# Altium schematic sheet 3.3v_Buck.SchDoc: 3.3v_Buck.SchDoc
size 558 x 431 mm; Date: 2/16/2022; Author: Xitong Zheng, Hongliang Chen; SheetNumber: 4; SheetTotal: 11
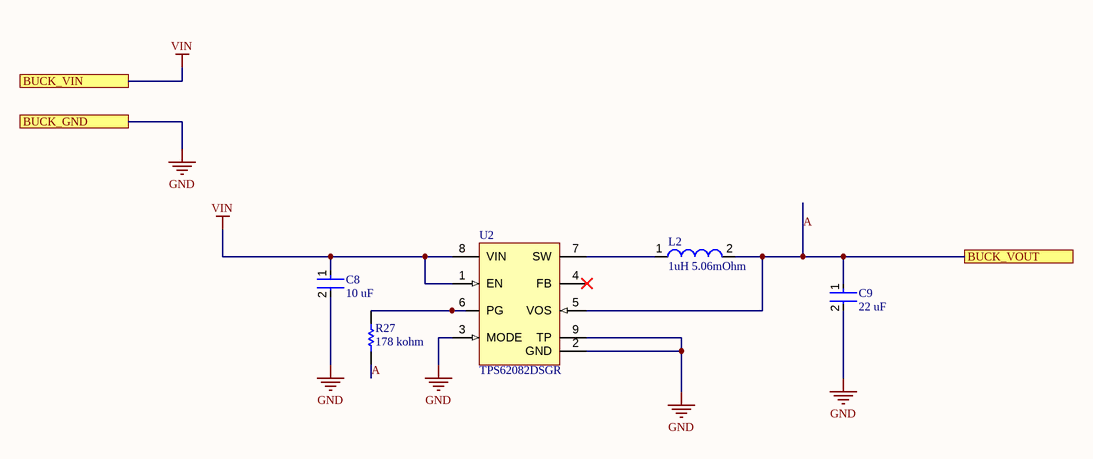
[diagram p0: 3.3v_Buck.SchDoc]

## Parts
C8  10 uF  [FP-GRJ155-0_2-MFG]
C9  22 uF  [FP-GRM21B-0_2-e0_2_0_7-IPC_B]
L2  1uH 5.06mOhm  [WE-HCI-7040]
R27  178 kohm  [RESC2013X70X40ML20T20]
U2  TPS62082DSGR  [DSG0008A_V]

## Ports
BUCK_GND, BUCK_VIN, BUCK_VOUT

## Nets
GND: C8.2 C9.2 U2.2(GND) U2.3(MODE) U2.9(TP) ; port BUCK_GND
VIN: C8.1 U2.1(EN) U2.8(VIN) ; port BUCK_VIN
A: C9.1 L2.2 R27.1 U2.5(VOS) ; port BUCK_VOUT
NetL2_1: L2.1 U2.7(SW)
NetR27_2: R27.2 U2.6(PG)

Not connected (* = marked no-connect by the designer): U2 4(FB)*

## Notes on the sheet
- DWG. NO.
- REV.
- SHT.
- REVISION
- DESCRIPTION
- DATE
- APPROVED
- THIS DOCUMENT AND THE DATA DISCLOSED HEREIN OR HEREWITH IS THE PROPERTY OF ALTIUM LIMITED AND MAY BE FREELY DISTRIBUTED IN WHOLE. NO RIGHTS ARE RESERVED OR EXPRESS OR IMPLIED WARANTEE GIVEN.
- ENG:
- DSN:
- APPROVALS
- PROJECT
- DOCUMENT REVISION:
- DESIGN ITEM:
- CHK:
- BOM:
- REFERENCE DOCUMENTS
- PROJECT REVISION:
- TITLE
- FAB DWG:
- PCB DWG:
- ASSY DWG:
- SCALE:
- SIZE
- C
- CAGE CODE
- FILE NAME
- DWG NO.
- SHEET
- OF
- REV

## Library data of the parts
C8 = CMP-06035-062410-1: CAP CER 10UF 6.3V X5R 0402; Tolerance: 20%; Length: 0.039inch; Width: 0.02inch; Capacitance: 10uF; Max Operating Temperature: 85°C; Features: Soft Termination; Case Code (Metric): 1005; Min Operating Temperature: -55°C; Thickness: 0.028inch; Mount: Surface Mount; Packaging: Cut Tape; Case/Package: 0402; Voltage Rating: 6.3V; Case Code (Imperial): 0402; RoHS Compliant: Yes
C9 = CMP-06035-048447-1: Chip Multilayer Ceramic Capacitors for General Purpose, 0805, 22uF, X7T, +22%/-33%, 20%, 6.3V; Case Code (Imperial): 0805; Capacitance: 22uF; Mount: Surface Mount; Packaging: Tape and Reel; Voltage Rating: 6.3V; Height: 1.25mm; Voltage Rating (DC): 6.3V; Case/Package: 0805; Weight: 0.000335oz; Dielectric: X7T; Length: 0.079inch; Width: 1.25mm; Package Quantity: 3000; Thickness: 0.057inch; Tolerance: 20%; Min Operating Temperature: -55°C; Case Code (Metric): 2012; Termination: SMD/SMT; Max Operating Temperature: 125°C; Resistor Type: Ceramic
L2 = CMP-0226-00067-1: SMD Flat Wire High Current Inductor WE-HCI, L=1.00 µH; Inductance: 1.00 ÂµH; PackageReference: WE-HCI-7040; ComponentLink2Description: Datasheet; ComponentLink1Description: Manufacturer Link; PackageVersion: 2008; ComponentLink2URL: http://www.we-online.de/katalog/media/pdf/744311100.pdf; DatasheetVersion: ver 1, Feb-2008; PackageDescription: SMD Inductor, 2-Leads, Body 7.0 x 6.9 mm; ComponentLink1URL: http://www.we-online.com
R27 = CMP-2001-00007-1: Part Number: ERJ-6ENF1783V; Manufacturer: Panasonic
U2 = CMP-0323-00344-3: Buck Step Down Regulator with 2.3 to 6 V Input and 3.3 V Output, -40 to 85 degC, 8-Pin WSON (DSG), Green (RoHS & no Sb/Br); Manufacturer: Texas Instruments; Switch Current Limit(Typ)(A): 2.4; Vin(Min)(V): 2.3; Iq(Typ)(mA): 0.006; Regulated Outputs(#): 1; Vout(Max)(V): 3.3; Duty Cycle(Max)(%): 100; Iout(Max)(A): 1.2; SubFamily: Step-Down Regulator; Rating: Catalog; Vin(Max)(V): 6; ComponentLink1Description: Datasheet; ComponentLink3Description: URL Link1; ComponentLink2URL: http://www.ti.com/litv/pdf/mpds308a; DatasheetVersion: SLVSAE8B; PackageVersion: revB, Oct-2010; Eco-Plan: Green (RoHS & no Sb/Br); ComponentLink2Description: Package Specification; PackageReference: DSG0008A; Code_JEDEC: MO-229; Topology: Buck; PartNumber: TPS62082DSGR; PackageDescription: 8-Pin Plastic Small Outline No-Lead, 2 x 2 x 0.8 mm Body, 0.5 mm Pitch, Exposed Pad; ComponentLink1URL: http://www.ti.com/general/docs/lit/getliterature.tsp?genericPartNumber=TPS62082&fileType=pdf; ComponentLink3URL: Samples URL:http://www.ti.com/product/tps62082#samples; Vout(Min)(V): 3.3; Mounting Technology: Surface Mount